# EAGLE design HardMountSensor (EAGLE 9.6.2)
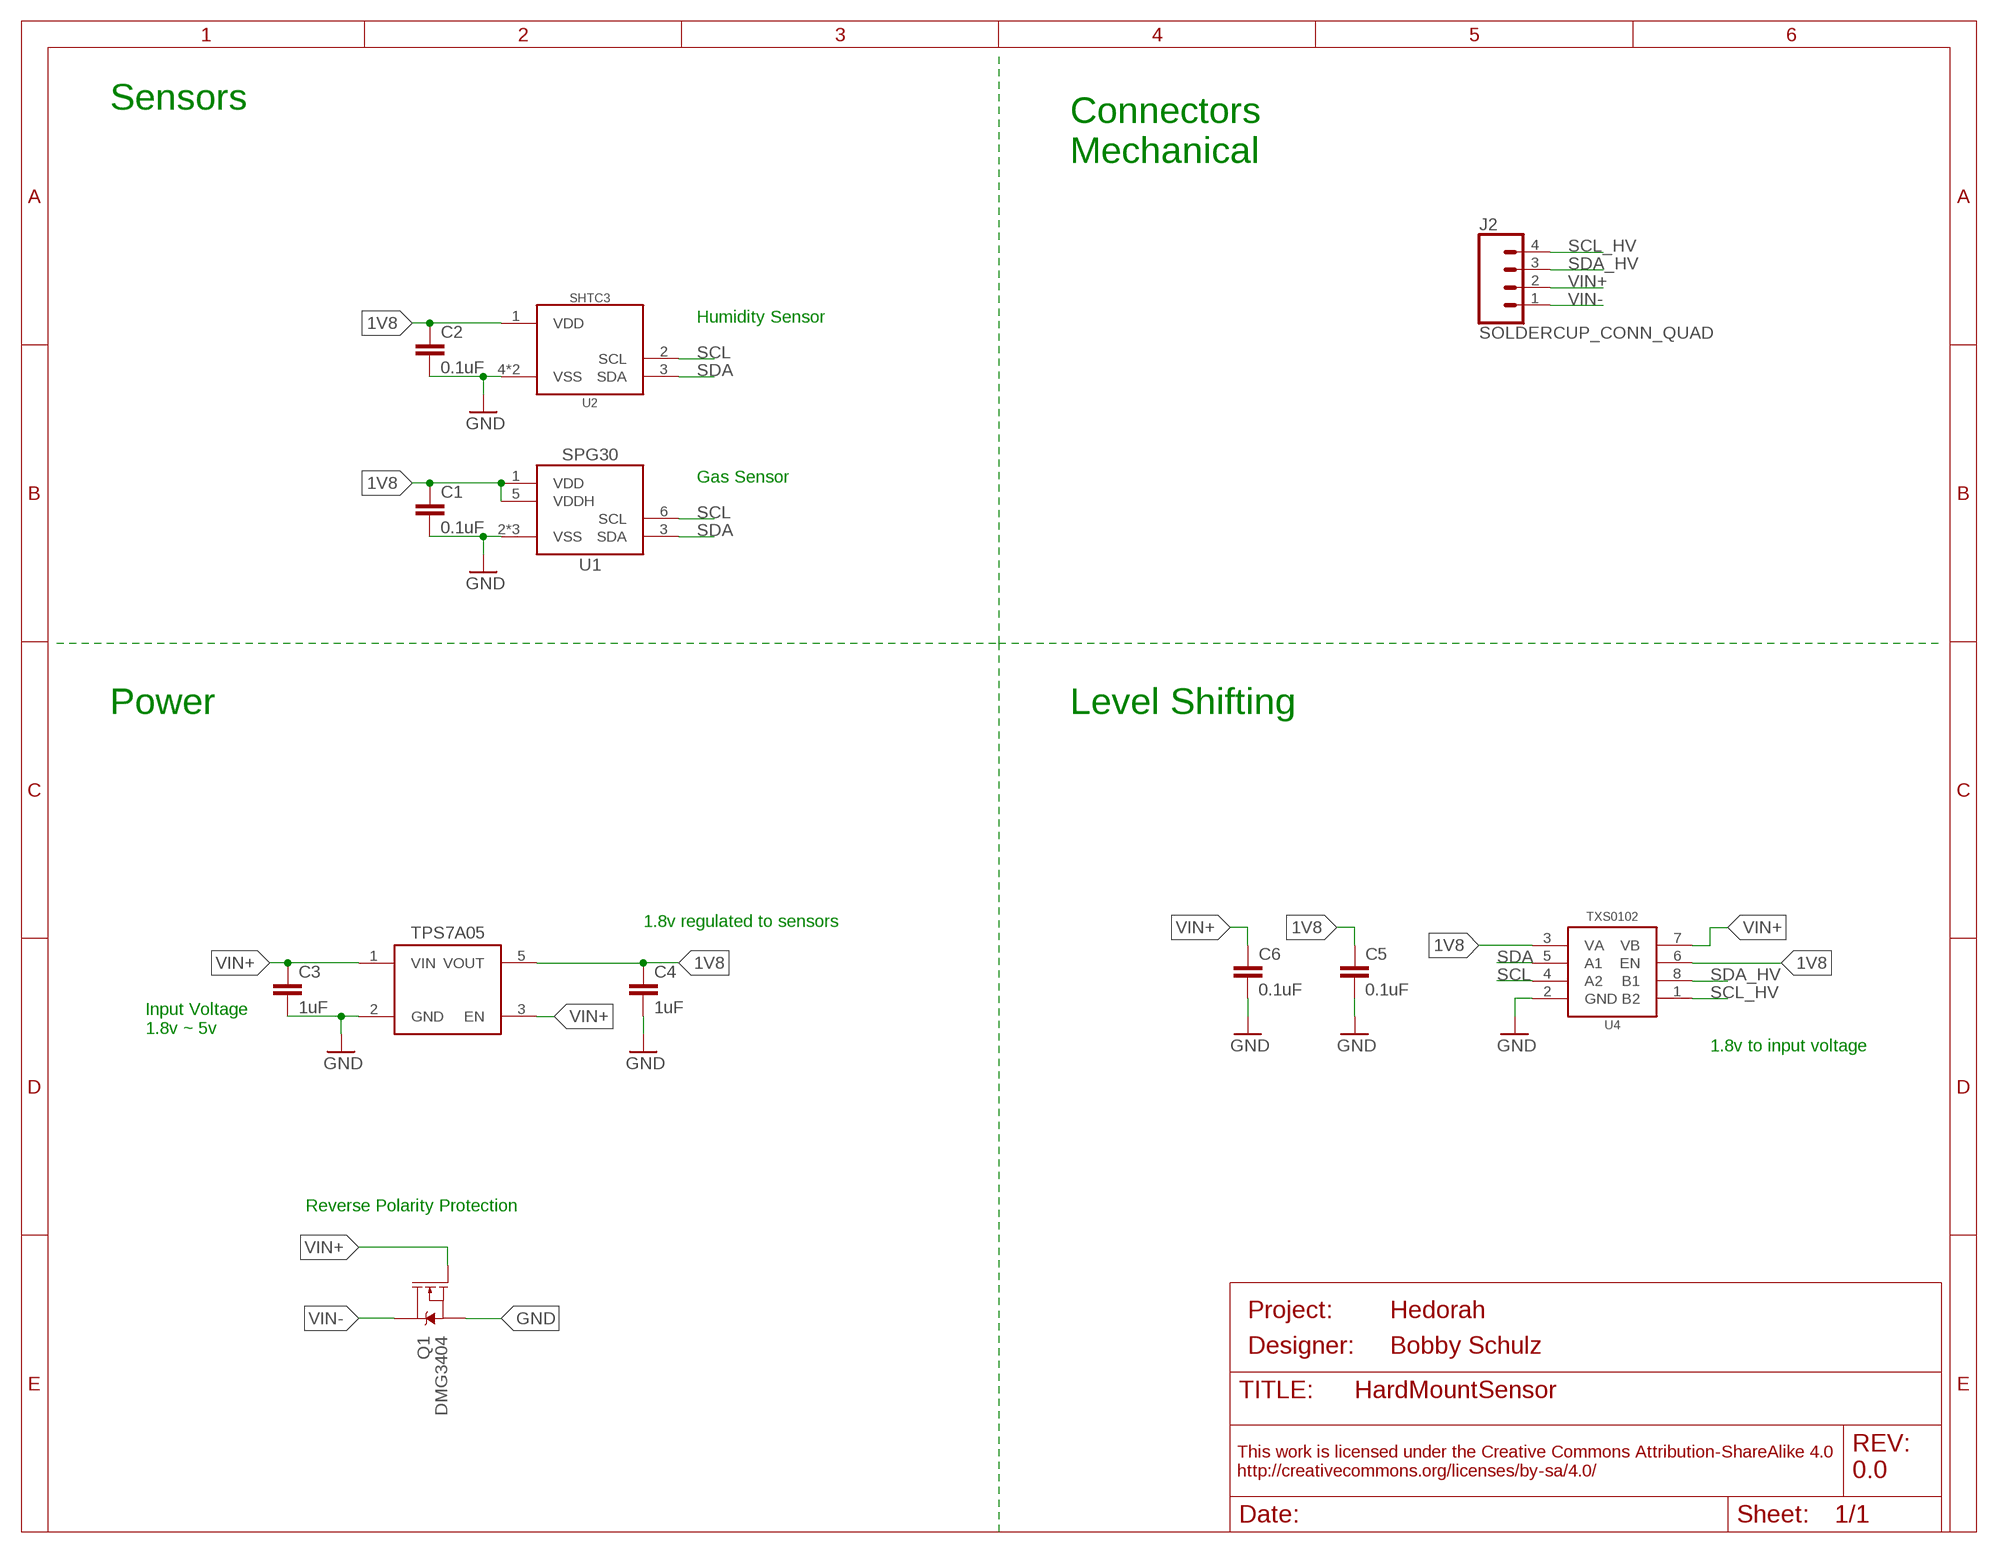
[diagram p0: schematic, sheet 1]
FRAME1 (FRAME_A_L): DESIGNER: Bobby Schulz; PROJECT: Hedorah; REV: 0.0

## Parts
C1  0.1uF  C-EU0.1UFC0603  [C0603]
C2  0.1uF  C-EU0.1UFC0603  [C0603]
C3  1uF  C-EU1UFC0603  [C0603]
C4  1uF  C-EU1UFC0603  [C0603]
C5  0.1uF  C-EU0.1UFC0603  [C0603]
C6  0.1uF  C-EU0.1UFC0603  [C0603]
J2  SOLDERCUP_CONN_QUAD  [SOLDERCUP_CONN_QUAD]
Q1  DMG3404  MOSFET-NCH-DMG3404L  [SOT23-3]
U1  SPG30  [DFN_6_2.5X2.5]
U2  SHTC3DFN  [DFN_4_2X2]
U3  TPS7A0518DBV  [SOT23-5]
U4  TXS0102DCU  [DCU_(R-PDSO-G8)]

## Nets
1V8: C1.1 C2.1 C4.1 C5.1 U1.1(VDD) U1.5(VDDH) U2.1(VDD) U3.5(VOUT) U4.3(VA) U4.6(EN)
GND: C1.2 C2.2 C3.2 C4.2 C5.2 C6.2 Q1.2(S) U1.2(VSS) U1.4(VSS) U1.EP(VSS) U2.4(VSS) U2.EP(VSS) U3.2(GND) U4.2(GND)
SCL: U1.6(SCL) U2.2(SCL) U4.4(A2)
SCL_HV: J2.4 U4.1(B2)
SDA: U1.3(SDA) U2.3(SDA) U4.5(A1)
SDA_HV: J2.3 U4.8(B1)
VIN+: C3.1 C6.1 J2.2 Q1.1(G) U3.1(VIN) U3.3(EN) U4.7(VB)
VIN-: J2.1 Q1.3(D)

## Notes on the sheet
- Sensors
- Connectors
  Mechanical
- Humidity Sensor
- Gas Sensor
- Power | Level Shifting
- 1.8v regulated to sensors
- Input Voltage
  1.8v ~ 5v
- 1.8v to input voltage
- Reverse Polarity Protection

## Library data of the parts
C1 C2 C5 C6 = bschulz_passives:C-EU: CAPACITOR, European symbol; DIGIKEY: 490-6051-1-ND; MF: Murata; MPN: GCM188R71E104KA57D
C3 C4 = bschulz_passives:C-EU: CAPACITOR, European symbol; DIGIKEY: 490-10479-1-ND; MF: Murata; MPN: GRM188R61C105KA12D
J2 = bschulz:SOLDERCUP_CONN_QUAD: Mounting pads for a M12 barel connector; DIGIKEY: A97650-ND; MF: TE Connectivity; MPN: 1838893-2
Q1 = bschulz:MOSFET-NCH: N-channel MOSFETs Voltage controlled devices that allow control of high current outputs. SparkFun Products: SparkFun OpenScale <https://www.sparkfun.com/products/13261> SparkFun Digital Sandbox <https://www.sparkfun.com/products/12651> SparkFun Monster Moto Shield <https://www.sparkfun.com/products/10182> SparkFun MOSFET Power Controller <https://www.sparkfun.com/products/11214>; DIGIKEY: DMG3404L-7DICT-ND; MF: Diodes Incorporated; MPN: DMG3404L-7
U1 = bschulz:SPG30: SGP30 - Multi-pixel Gas Sensor (TVOC, CO2EQ) Characteristics: Vcc: 1.8V Gas Sensing: Ethanol, H2, TVOC, CO2eq Sample Rate: 1Hz (Air Quality), 40Hz (Gas) Operating Temperature: -40°C to 85°C Digikey: 1649-1084-1-ND <https://www.digikey.com/product-detail/en/sensirion-ag/SGP30-2.5K/1649-1084-1-ND/7400967>; DIGIKEY: 1649-1084-1-ND; MF: Sensirion; MPN: SGP30-2.5K
U2 = bschulz:SHTC*: SHTCx - Digital Humidity and Temperature Sensor Characteristics (for SHTC3): Vcc: 1.62V ~ 3.6V Humidity Resolution: 0.01% RH Humidity Accuracy: ±2% RH Temperature Resolution: 0.01°C Temperature Accuracy: 0.2°C Operating Temperature: -40°C to 125°C Digikey: 1649-1100-1-ND (SHTC3) <https://www.digikey.com/product-detail/en/sensirion-ag/SHTC3/1649-1100-1-ND/8628149> 1649-1015-1-ND (SHTC1) <https://www.digikey.com/product-detail/en/sensirion-ag/SHTC1/1649-1015-1-ND/5872297>; DIGIKEY: 1649-1100-1-ND; DISP: SHTC3; MF: Sensirion; MPN: SHTC3
U3 = bschulz:TPS7A05*: TPS7A05* - Ultra Low Power Low Dropout Linear Regulator Characteristics: Vin: 1.4V ~ 5.5V Vout: 0.8, 1.0, 1.2, 1.5, 1.8, 2.5, 2.85, 3.3V fixed IQ: 1μA typ, 3μA max Voltage Accuracy: 1% typ, 3% max Output Current: 200 mA Operating Temperature: -40°C to 125°C Mouser: TPS7A0533 (3.3V Fixed) <https://www.mouser.com/ProductDetail/Texas-Instruments/TPS7A0533PDBVR?qs=sGAEpiMZZMsGz1a6aV8DcD1rpA6FsR3J1Mp5DdTpiXw%3d> TPS7A0518 (1.8V Fixed) <https://www.mouser.com/ProductDetail/Texas-Instruments/TPS7A0518PDBVR?qs=sGAEpiMZZMsGz1a6aV8DcD1rpA6FsR3J1f7DNYacdSI%3d>; DIGIKEY: 1649-1015-1-ND; MF: TI; MOUSER: 595-TPS7A0518PDBVR; MPN: TPS7A0518PDBVR
U4 = bschulz:TXS0102: TXS0102 - 2 Channel Bidirectional Voltage Level Translator Characteristics: Vcc: 1.65 ~ 3.6V (Port A), 2.3 ~ 5.5V (Port B) IQ: 14.4μA Output Current: 50mA Output Type: Open Drain/Push-Pull Operating Temperature: -40°C to 85°C Digikey: 296-28368-1-ND (DQE) <https://www.digikey.com/product-detail/en/texas-instruments/TXS0102DQER/296-28368-1-ND/2625893> 296-28435-1-ND (DQM) <https://www.digikey.com/product-detail/en/texas-instruments/TXS0102DQMR/296-28435-1-ND/2638910> 296-21931-1-ND (DCU) <https://www.digikey.com/product-detail/en/texas-instruments/TXS0102DCUR/296-21931-1-ND/1629284>; DIGIKEY: 296-21931-1-ND; MF: TI; MPN: TXS0102DCUR

## Board
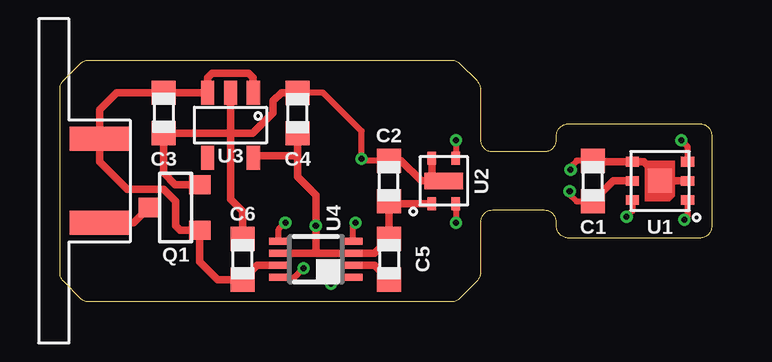
[diagram p1: board, top side]
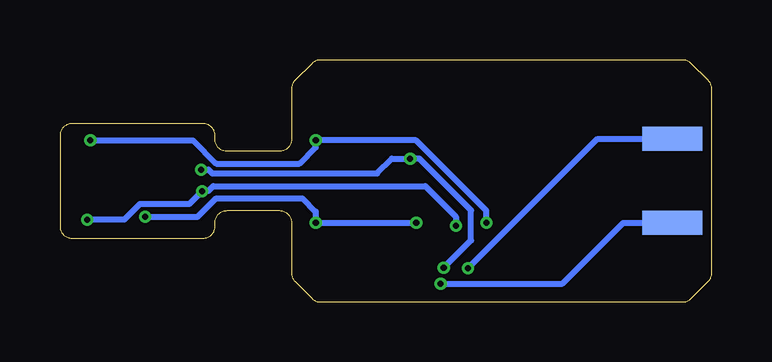
[diagram p2: board, bottom side, seen from below]

Size 27.18 x 10.08 mm. Coordinates in mm from the lower left corner, seen from the top.
Outline: 20.2,3.81 18.02,3.81 arc90 17.52,3.31 17.52,1.21 arc-45 17.38,0.85 16.67,0.15 arc-45 16.32,0 1.21,0 arc-45 0.85,0.15 0.15,0.85 arc-45 0,1.21 0,8.87 arc-45 0.15,9.23 0.85,9.93 arc-45 1.21,10.08 16.32,10.08 arc-45 16.67,9.93 17.38,9.23 arc-45 17.52,8.87 17.52,6.77 arc90 18.02,6.27 20.2,6.27 arc90 20.7,6.77 20.7,6.92 arc-90 21.2,7.42 26.68,7.42 arc-90 27.18,6.92 27.18,3.15 arc-90 26.68,2.65 21.2,2.65 arc-90 20.7,3.15 20.7,3.31 arc90 20.2,3.81
Copper layers (1*16): Top 0.035559375mm / dielectric 1.6mm / Bottom 0.035559375mm
Design rules "oshpark-2layer": minimum track width 6mil, minimum drill 10mil, track to track 6mil, track to pad 6mil, pad to pad 6mil, via to via 6mil, smd to smd 6mil, copper to edge 15mil, drill to drill 6mil, minimum pad ring 5mil, minimum via ring 5mil, stop-mask expansion 2.5mil, vias tented up to drill 0mil, thermal gap 10mil

### Footprints (pad centres in the part's own frame; a part is rotated, then mirrored left to right if it is on the bottom)
C0603 = smd 1 x 1: 1 -0.85,0; 2 0.85,0
SOLDERCUP_CONN_QUAD = smd 1 x 2.5: 1 1.75,1.27; 2 -1.75,1.27 | smd 1 x 2.5 bottom: 3 -1.75,1.27; 4 1.75,1.27
SOT23-3 = smd 0.8 x 0.9: 1 -0.95,-1; 2 0.95,-1; 3 0,1.1
DFN_6_2.5X2.5 = smd 0.55 x 0.4: 1 -1.15,0.8; 2 -1.15,0; 3 -1.15,-0.8; 4 1.15,-0.8; 5 1.15,0; 6 1.15,0.8 | smd 1 x 1: EP 0,0
DFN_4_2X2 = smd 0.55 x 0.35: 1 -0.95,0.5; 2 -0.95,-0.5; 3 0.95,-0.5; 4 0.95,0.5 | smd 0.7 x 1.6: EP 0,0
SOT23-5 = smd 0.55 x 1: 1 -0.95,-1.35; 2 0,-1.35; 3 0.95,-1.35; 4 0.95,1.35; 5 -0.95,1.35
DCU_(R-PDSO-G8) = smd 0.3 x 0.8: 1 -0.75,-1.55; 2 -0.25,-1.55; 3 0.25,-1.55; 4 0.75,-1.55; 5 0.75,1.55; 6 0.25,1.55; 7 -0.25,1.55; 8 -0.75,1.55

### Placement (x,y rotation side)
C1  22.23,5.04 90 top
C2  13.72,5.04 90 top
C3  4.32,7.87 270 top
C4  9.91,7.87 90 top
C5  13.72,1.78 270 top
C6  7.62,1.78 90 top
J2  0.38,5.04 270 top
Q1  4.83,3.94 90 top
U1  25.02,5.04 180 top
U2  16,5.04 90 top
U3  7.11,7.37 180 top
U4  10.67,1.78 90 top

### Tracks (layer width: path | path; a pad name or v marks a point on that pad's centre or on a via)
1V8  (via drill 0.25)
  Top 0.254: v21.25,4.61 21.25,4.49 21.54,4.19 C1.1 | v26.04,3.43 26.17,3.56 U1.1
  Top 0.305: U2.1 13.82,4.09 C2.1 C5.1 13.12,2.03 U4.3 10.67,2.03 | U4.6 10.67,2.03 | U1.5 23.07,5.04 C1.1 | 10.67,2.03 v10.67,3.17 10.67,4.45 9.91,5.21 9.91,6.1 | 9.91,6.1 C4.1 | U3.5 8.14,6.1 9.91,6.1
  Bottom 0.254: v26.04,3.43 24.49,3.43 23.84,4.08 21.78,4.08 v21.25,4.61 21,4.61 20.78,4.83 11.94,4.83 10.67,3.56 v10.67,3.17
GND  (via drill 0.25)
  Top 0.254: C1.2 21.54,5.89 21.29,5.63 v21.29,5.51 | C4.2 10.96,8.72 12.57,7.11 v12.57,5.97 12.65,5.89 C2.2 | U4.2 11.54,1.53 11.43,1.42 v11.18,1.42
  Top 0.305: C2.2 14.22,5.89 15.07,5.04 15.49,5.04 | 15.49,5.04 U2.EP | U2.4 15.5,5.05 15.49,5.04 | C5.2 13.12,1.53 U4.2 | U1.EP 25.15,5.04 | 25.15,5.04 U1.2 | 25.15,5.04 24.35,5.84 U1.4 22.27,5.84 C1.2 | 7.11,7.02 8.04,7.02 8.89,7.87 8.89,8.38 9.23,8.72 C4.2 | 7.11,7.02 C3.2 4.32,5.38 4.81,4.89 Q1.2 | U3.2 7.11,7.02 | C6.2 7.62,3.77 7.11,4.28 7.11,7.02
  Bottom 0.254: v21.29,5.51 20.98,5.51 20.83,5.36 13.95,5.36 13.34,5.97 v12.57,5.97 12.19,5.97 10.03,3.81 10.03,2.56 v11.18,1.42
SCL  (via drill 0.25)
  Top 0.254: U1.6 23.87,3.79 v23.62,3.54 | U2.2 v16.51,3.3 | U4.4 12.22,3.2 v12.32,3.3
  Bottom 0.254: v23.62,3.54 21.43,3.54 20.66,4.32 17.06,4.32 16.51,3.77 v16.51,3.3 v12.32,3.3
SCL_HV  (via drill 0.25)
  Top 0.254: U4.1 11.57,1.03 v11.3,0.76
  Bottom 0.254: v11.3,0.76 6.22,0.76 3.69,3.29 J2.4
SDA  (via drill 0.25)
  Top 0.254: U1.3 26.17,6.47 v25.91,6.73 | v16.51,6.73 U2.3 | U4.5 9.12,3.02 v9.4,3.3
  Bottom 0.254: v25.91,6.73 21.63,6.73 20.66,5.76 17.19,5.76 16.51,6.44 v16.51,6.73 12.33,6.73 9.4,3.8 v9.4,3.3
SDA_HV  (via drill 0.25)
  Top 0.254: U4.8 9.79,1.03 v10.16,1.4
  Bottom 0.254: v10.16,1.4 4.77,6.79 J2.3
VIN+
  Top 0.305: U4.7 8.22,1.53 C6.1 6.57,0.93 5.83,1.67 Q1.1 | U3.1 8.06,9.34 7.87,9.53 6.35,9.53 6.16,9.34 U3.3 C3.1 2.37,8.72 1.65,8 J2.2 1.65,5.84 2.79,4.7 4.32,4.7 4.83,4.19 4.83,3.17 5.01,2.99 Q1.1 | 5.83,3.19 Q1.1
VIN-
  Top 0.305: J2.1 3.08,3.29 Q1.3

### Text on the board
tDocu: Vin+ | Vin-
bDocu: SDA | Project Hedorah v0.0 / Hard Mount / Bobby Schulz | SCL